# Altium project BPC_PWR_v1.1.PrjPcb (part 2 of 4)
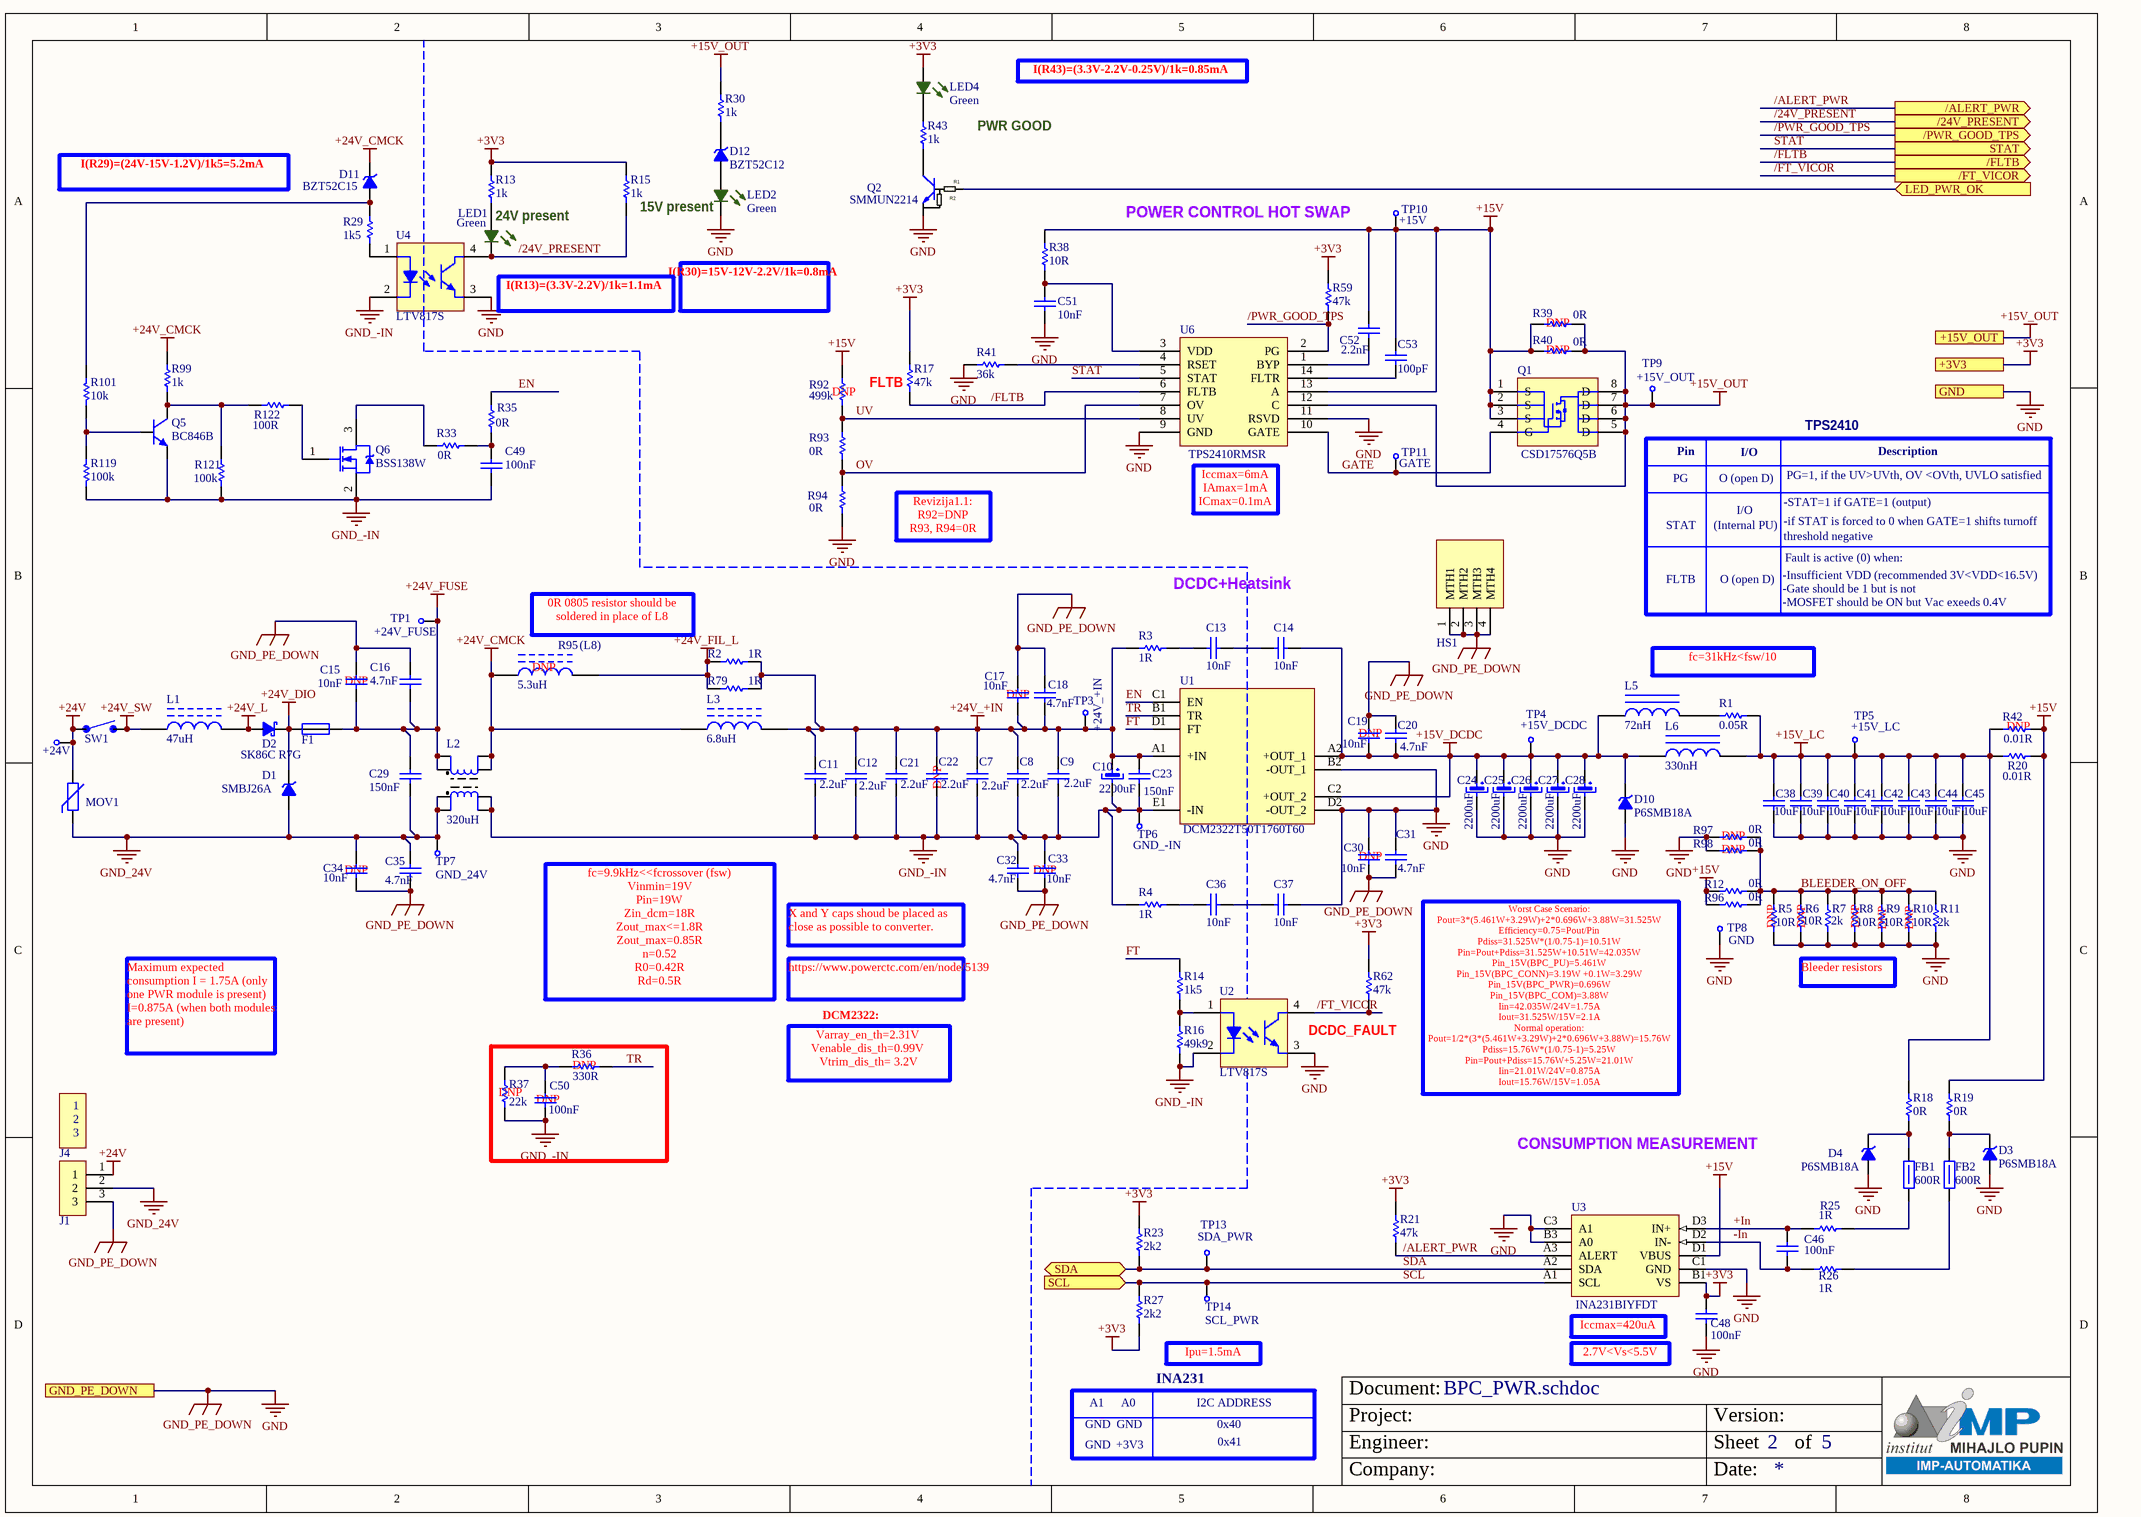
[diagram p5: BPC_PWR.schdoc]

## Sheet BPC_PWR.schdoc: Eurocard VME 6U (9.187 x 6.299 inches) (continued)

### Parts
+24V  Test Point Comment  [TP SMD 1.2mm MS]  (value not drawn)  (no BOM)
C7  Capacitance: 2.2uF  [2220 C 2.8MM MS]  (hidden comment: Ceramic Capacitor)
C8  Capacitance: 2.2uF  [2220 C 2.8MM MS]  (hidden comment: Ceramic Capacitor)
C9  Capacitance: 2.2uF  [2220 C 2.8MM MS]  (hidden comment: Ceramic Capacitor)
C10  Capacitance: 2200uF  [CAPPRD750W85D1800H2000 MS]  (hidden comment: Electorlytic Capacitor)
C11  Capacitance: 2.2uF  [2220 C 2.8MM MS]  (hidden comment: Ceramic Capacitor)
C12  Capacitance: 2.2uF  [2220 C 2.8MM MS]  (hidden comment: Ceramic Capacitor)
C13  Capacitance: 10nF  [1812 C 2.0MM MS]  (hidden comment: Ceramic Capacitor)
C14  Capacitance: 10nF  [1812 C 2.0MM MS]  (hidden comment: Ceramic Capacitor)
C15  Populated: DNP  DB Parameter 1: 10nF  [R46KI21000001M]  (hidden comment: Capacitor Y2)
C16  DB Parameter 1: 4.7nF  [R60QF14704001K]  (hidden comment: Capacitor Y2)
C17  Populated: DNP  DB Parameter 1: 10nF  [R46KI21000001M]  (hidden comment: Capacitor Y2)
C18  DB Parameter 1: 4.7nF  [R60QF14704001K]  (hidden comment: Capacitor Y2)
C19  Populated: DNP  DB Parameter 1: 10nF  [R46KI21000001M]  (hidden comment: Capacitor Y2)
C20  DB Parameter 1: 4.7nF  [R60QF14704001K]  (hidden comment: Capacitor Y2)
C21  Capacitance: 2.2uF  [2220 C 2.8MM MS]  (hidden comment: Ceramic Capacitor)
C22  Populated: DNP  Capacitance: 2.2uF  [2220 C 2.8MM MS]  (hidden comment: Ceramic Capacitor)
C23  DB Parameter 1: 150nF  [MKX2 6mmx18mmx12.5mm]  (hidden comment: Capacitor X2)
C24  Capacitance: 2200uF  [CAPPRD750W85D1800H2000 MS]  (hidden comment: Electorlytic Capacitor)
C25  Capacitance: 2200uF  [CAPPRD750W85D1800H2000 MS]  (hidden comment: Electorlytic Capacitor)
C26  Capacitance: 2200uF  [CAPPRD750W85D1800H2000 MS]  (hidden comment: Electorlytic Capacitor)
C27  Capacitance: 2200uF  [CAPPRD750W85D1800H2000 MS]  (hidden comment: Electorlytic Capacitor)
C28  Capacitance: 2200uF  [CAPPRD750W85D1800H2000 MS]  (hidden comment: Electorlytic Capacitor)
C29  DB Parameter 1: 150nF  [MKX2 6mmx18mmx12.5mm]  (hidden comment: Capacitor X2)
C30  Populated: DNP  DB Parameter 1: 10nF  [R46KI21000001M]  (hidden comment: Capacitor Y2)
C31  DB Parameter 1: 4.7nF  [R60QF14704001K]  (hidden comment: Capacitor Y2)
C32  DB Parameter 1: 4.7nF  [R60QF14704001K]  (hidden comment: Capacitor Y2)
C33  Populated: DNP  DB Parameter 1: 10nF  [R46KI21000001M]  (hidden comment: Capacitor Y2)
C34  Populated: DNP  DB Parameter 1: 10nF  [R46KI21000001M]  (hidden comment: Capacitor Y2)
C35  DB Parameter 1: 4.7nF  [R60QF14704001K]  (hidden comment: Capacitor Y2)
C36  Capacitance: 10nF  [1812 C 2.0MM MS]  (hidden comment: Ceramic Capacitor)
C37  Capacitance: 10nF  [1812 C 2.0MM MS]  (hidden comment: Ceramic Capacitor)
C38  Capacitance: 10uF  [2220 C 2.8MM MS]  (hidden comment: Ceramic Capacitor)
C39  Capacitance: 10uF  [2220 C 2.8MM MS]  (hidden comment: Ceramic Capacitor)
C40  Capacitance: 10uF  [2220 C 2.8MM MS]  (hidden comment: Ceramic Capacitor)
C41  Capacitance: 10uF  [2220 C 2.8MM MS]  (hidden comment: Ceramic Capacitor)
C42  Capacitance: 10uF  [2220 C 2.8MM MS]  (hidden comment: Ceramic Capacitor)
C43  Capacitance: 10uF  [2220 C 2.8MM MS]  (hidden comment: Ceramic Capacitor)
C44  Capacitance: 10uF  [2220 C 2.8MM MS]  (hidden comment: Ceramic Capacitor)
C45  Capacitance: 10uF  [2220 C 2.8MM MS]  (hidden comment: Ceramic Capacitor)
C46  Capacitance: 100nF  [C0603L 0.8 MM MS]  (hidden comment: Ceramic Capacitor)
C48  Capacitance: 100nF  [C0603L 0.8 MM MS]  (hidden comment: Ceramic Capacitor)
C49  Capacitance: 100nF  [C0603L 0.8 MM MS]  (hidden comment: Ceramic Capacitor)
C50  Production Status: DNP  Capacitance: 100nF  [C0603L 0.8 MM MS]  (hidden comment: Ceramic Capacitor)
C51  Capacitance: 10nF  [C0603L 0.8 MM MS]  (hidden comment: Ceramic Capacitor)
C52  Capacitance: 2.2nF  [C0603L 0.8 MM MS]  (hidden comment: Ceramic Capacitor)
C53  Capacitance: 100pF  [C0603L 0.8 MM MS]  (hidden comment: Ceramic Capacitor)
D1  SMBJ26A  [DO-214AA SMB MS]
D2  SK86C R7G  [DIOM7959X262N]
D3  P6SMB18A  [DO-214AA SMB MS]
D4  P6SMB18A  [DO-214AA SMB MS]
D10  P6SMB18A  [DO-214AA SMB MS]
D11  BZT52C15  [SOD-123 MS]
D12  BZT52C12  [SOD-123 MS]
F1  FUSEHOLDER  [FUSEHOLDER_00318221]  (value not drawn)
FB1  Impedance @ 100MHz: 600R  [0805 FB 0.85mm MS]  (hidden comment: Ferrite Bead)
FB2  Impedance @ 100MHz: 600R  [0805 FB 0.85mm MS]  (hidden comment: Ferrite Bead)
HS1  Heatsink  [Heatsink VICOR Tranverse Grounding Tabs Thermal 40138]  (value not drawn)
J1  Header Male TH 3-pin  [MSTB 2,5_3-GF-5,08 - 1776511]  (value not drawn)
J4  Header Male TH 3-pin  [MSTB 2,5/ 3-STF-5,08 - 1777992]  (value not drawn)  (mechanical)
L1  Inductance: 47uH  [SER1390153MLB]  (hidden comment: Inductor)
L2  Inductance: 320uH  [WE-UCF]  (hidden comment: Inductor Common Mode Choke)
L3  Inductance: 6.8uH  [INDPM110100X400N_MSS1048]  (hidden comment: Inductor)
L5  Inductance: 72nH  [IFLR2727]  (hidden comment: Inductor)
L6  Inductance: 330nH  [IHLP3232]  (hidden comment: Inductor)
LED1  Green  [LED GRN Mentor 2632.8380 x1]
LED2  Green  [LED GRN Mentor 2632.8380 x1]
LED4  Green  [LED GRN Mentor 2632.8380 x1]
MOV1  Varistor  [MOV10D470K]  (value not drawn)
Q1  CSD17576Q5B  [DNK8 MS]
Q2  SMMUN2214  [SOT-23 MS]
Q5  BC846B  [SOT-23 NXP MS]
Q6  BSS138W  [SOT65P210X110-3N]
R1  Resistance: 0.05R  [2512 R 0.7mm MS]  (hidden comment: Resistor)
R2  Resistance: 1R  [2512 R 0.7mm MS]  (hidden comment: Resistor)
R3  Resistance: 1R  [2512 R 0.7mm MS]  (hidden comment: Resistor)
R4  Resistance: 1R  [2512 R 0.7mm MS]  (hidden comment: Resistor)
R5  Populated: DNP  Resistance: 10R  [2512 R 0.7mm MS]  (hidden comment: Resistor)
R6  Populated: DNP  Resistance: 10R  [2512 R 0.7mm MS]  (hidden comment: Resistor)
R7  Resistance: 2k  [2512 R 0.7mm MS]  (hidden comment: Resistor)
R8  Populated: DNP  Resistance: 10R  [2512 R 0.7mm MS]  (hidden comment: Resistor)
R9  Populated: DNP  Resistance: 10R  [2512 R 0.7mm MS]  (hidden comment: Resistor)
R10  Populated: DNP  Resistance: 10R  [2512 R 0.7mm MS]  (hidden comment: Resistor)
R11  Resistance: 2k  [2512 R 0.7mm MS]  (hidden comment: Resistor)
R12  Resistance: 0R  [R0603L 0.45MM MS]  (hidden comment: Resistor)
R13  Resistance: 1k  [R0603L 0.45MM MS]  (hidden comment: Resistor)
R14  Resistance: 1k5  [R0603L 0.45MM MS]  (hidden comment: Resistor)
R15  Resistance: 1k  [R0603L 0.45MM MS]  (hidden comment: Resistor)
R16  Resistance: 49k9  [R0603L 0.45MM MS]  (hidden comment: Resistor)
R17  Resistance: 47k  [R0603L 0.45MM MS]  (hidden comment: Resistor)
R18  Resistance: 0R  [0805 R 0.5mm MS]  (hidden comment: Resistor)
R19  Resistance: 0R  [0805 R 0.5mm MS]  (hidden comment: Resistor)
R20  Resistance: 0.01R  [2512 R 0.7mm MS]  (hidden comment: Resistor)
R21  Resistance: 47k  [R0603L 0.45MM MS]  (hidden comment: Resistor)
R23  Resistance: 2k2  [R0603L 0.45MM MS]  (hidden comment: Resistor)
R25  Resistance: 1R  [R0603L 0.45MM MS]  (hidden comment: Resistor)
R26  Resistance: 1R  [R0603L 0.45MM MS]  (hidden comment: Resistor)
R27  Resistance: 2k2  [R0603L 0.45MM MS]  (hidden comment: Resistor)
R29  Resistance: 1k5  [R0603L 0.45MM MS]  (hidden comment: Resistor)
R30  Resistance: 1k  [R0603L 0.45MM MS]  (hidden comment: Resistor)
R33  Resistance: 0R  [R0603L 0.45MM MS]  (hidden comment: Resistor)
R35  Resistance: 0R  [R0603L 0.45MM MS]  (hidden comment: Resistor)
R36  Populated: DNP  Resistance: 330R  [R0603L 0.45MM MS]  (hidden comment: Resistor)
R37  Populated: DNP  Resistance: 22k  [R0603L 0.45MM MS]  (hidden comment: Resistor)
R38  Resistance: 10R  [1206 R 0.6mm MS]  (hidden comment: Resistor)
R39  Populated: DNP  Resistance: 0R  [2512 R 0.7mm MS]  (hidden comment: Resistor)
R40  Populated: DNP  Resistance: 0R  [2512 R 0.7mm MS]  (hidden comment: Resistor)
R41  Resistance: 36k  [R0603L 0.45MM MS]  (hidden comment: Resistor)
R42  Populated: DNP  Resistance: 0.01R  [2512 R 0.7mm MS]  (hidden comment: Resistor)
R43  Resistance: 1k  [R0603L 0.45MM MS]  (hidden comment: Resistor)
R59  Resistance: 47k  [R0603L 0.45MM MS]  (hidden comment: Resistor)
R62  Resistance: 47k  [R0603L 0.45MM MS]  (hidden comment: Resistor)
R79  Resistance: 1R  [2512 R 0.7mm MS]  (hidden comment: Resistor)
R92  Populated: DNP  Resistance: 499k  [R0603L 0.45MM MS]  (hidden comment: Resistor)
R93  Resistance: 0R  [R0603L 0.45MM MS]  (hidden comment: Resistor)
R94  Resistance: 0R  [R0603L 0.45MM MS]  (hidden comment: Resistor)
R95  Populated: DNP  Inductance: 5.3uH  [WE-TPC_5818/582892]  (hidden comment: Inductor)
R96  Resistance: 0R  [R0603L 0.45MM MS]  (hidden comment: Resistor)
R97  Populated: DNP  Resistance: 0R  [R0603L 0.45MM MS]  (hidden comment: Resistor)
R98  Populated: DNP  Resistance: 0R  [R0603L 0.45MM MS]  (hidden comment: Resistor)
R99  Resistance: 1k  [R0603L 0.45MM MS]  (hidden comment: Resistor)
R101  Resistance: 10k  [R0603L 0.45MM MS]  (hidden comment: Resistor)
R119  Resistance: 100k  [R0603L 0.45MM MS]  (hidden comment: Resistor)
R121  Resistance: 100k  [R0603L 0.45MM MS]  (hidden comment: Resistor)
R122  Resistance: 100R  [R0603L 0.45MM MS]  (hidden comment: Resistor)
SW1  Switch  [SWITCH_HOLES]  (value not drawn)
TP1  +24V_FUSE  [TP SMD 1.2mm MS]  (no BOM)
TP3  +24V_+IN  [TP SMD 1.2mm MS]  (no BOM)
TP4  +15V_DCDC  [TP SMD 1.2mm MS]  (no BOM)
TP5  +15V_LC  [TP SMD 1.2mm MS]  (no BOM)
TP6  GND_-IN  [TP SMD 1.2mm MS]  (no BOM)
TP7  GND_24V  [TP SMD 1.2mm MS]  (no BOM)
TP8  GND  [TP SMD 1.2mm MS]  (no BOM)
TP9  +15V_OUT  [TP SMD 1.2mm MS]  (no BOM)
TP10  +15V  [TP SMD 1.2mm MS]  (no BOM)
TP11  GATE  [TP SMD 1.2mm MS]  (no BOM)
TP13  SDA_PWR  [TP SMD 1.2mm MS]  (no BOM)
TP14  SCL_PWR  [TP SMD 1.2mm MS]  (no BOM)
U1  DCM2322T50T1760T60  [DCM2322 MS]
U2  LTV817S  [LTV814S]
U3  INA231BIYFDT  [DSBGA-12]
U4  LTV817S  [LTV814S]
U6  TPS2410RMSR  [QFN50P250X250X60-14N]

### Ports
+3V3, +15V_OUT, /24V_PRESENT (out), /ALERT_PWR (out), /FLTB (out), /FT_VICOR (out), /PWR_GOOD_TPS (out), GND, GND_PE_DOWN, LED_PWR_OK (in), SCL (in), SDA (bidir), STAT (out)

### Nets
+3V3: C48.1 LED4.A R13.2 R15.1 R17.2 R21.2 R23.2 R27.2 R59.2 R62.2 U3.B1(VS) ; port +3V3
+15V: C52.2 C53.1 Q1.1(S) Q1.2(S) Q1.3(S) R12.2 R19.2 R20.2 R38.2 R39.1 R40.1 R42.2 R92.2 R96.2 TP10.1 U3.D1(VBUS) U6.13(A)
+15V_DCDC: C14.1 C19.2 C20.2 C24.1 C25.1 C26.1 C27.1 C28.1 D10.K L5.1 L6.1 TP4.1 U1.A2(+OUT_1) U1.C2(+OUT_2)
+15V_LC: C38.1 C39.1 C40.1 C41.1 C42.1 C43.1 C44.1 C45.1 L6.2 R1.2 R18.2 R20.1 R42.1 TP5.1
+15V_OUT: Q1.5(D) Q1.6(D) Q1.7(D) Q1.8(D) R30.2 R39.2 R40.2 TP9.1 U6.12(C) ; port +15V_OUT
+24V: +24V.1 J1.1 MOV1.2 SW1.1
+24V_+IN: C7.1 C8.1 C9.1 C10.1 C11.1 C12.1 C17.1 C18.2 C21.1 C22.1 C23.1 L3.2 R2.2 R3.1 R79.2 TP3.1 U1.A1(+IN)
+24V_CMCK: D11.K L2.9 L2.10 L3.1 R95.1 R99.1
+24V_DIO: D1.K D2.1(K) F1.1
+24V_FIL_L: R2.1 R79.1 R95.2
+24V_FUSE: C15.2 C16.2 C29.1 F1.2 L2.1 L2.2 TP1.1
+24V_L: D2.2(A) L1.2
+24V_SW: L1.1 SW1.2
GND: C15.1 C16.1 C17.2 C18.1 C19.1 C20.1 C24.2 C25.2 C26.2 C27.2 C28.2 C30.1 C30.2 C31.1 C31.2 C32.2 C33.2 C34.2 C35.2 C37.1 C38.2 C39.2 C40.2 C41.2 C42.2 C43.2 C44.2 C45.2 C48.2 C51.1 D3.A D4.A D10.A HS1.1(MTH1) HS1.2(MTH2) HS1.3(MTH3) HS1.4(MTH4) J1.3 LED2.K Q2.2 R5.1 R6.1 R7.1 R8.1 R9.1 R10.1 R11.1 R41.1 R94.1 R97.2 R98.2 TP8.1 U1.B2(-OUT_1) U1.D2(-OUT_2) U2.3(Emitter) U3.B3(A0) U3.C1(GND) U3.C3(A1) U4.3(Emitter) U6.9(GND) U6.11(RSVD) ; port GND_PE_DOWN, port GND  [also labelled GND_PE_DOWN]
GND_24V: C29.2 C34.1 C35.1 D1.A J1.2 L2.4 L2.5 MOV1.1 TP7.1
GND_-IN: C7.2 C8.2 C9.2 C10.2 C11.2 C12.2 C21.2 C22.2 C23.2 C32.1 C33.1 C49.2 C50.2 L2.6 L2.7 Q5.2(E) Q6.2(S) R4.1 R16.1 R37.1 R119.1 R121.2 TP6.1 U1.E1(-IN) U2.2(Cathode) U4.2(Cathode)
+In: C46.1 R25.1 U3.D3(IN+)
-In: C46.2 R26.1 U3.D2(IN-)
/24V_PRESENT: LED1.K R15.2 U4.4(Collector) ; port /24V_PRESENT
/ALERT_PWR: R21.1 U3.A3(ALERT) ; port /ALERT_PWR
/FLTB: R17.1 U6.6(FLTB) ; port /FLTB
/FT_VICOR: R62.1 U2.4(Collector) ; port /FT_VICOR
/PWR_GOOD_TPS: R59.1 U6.2(PG) ; port /PWR_GOOD_TPS
BLEEDER_ON_OFF: R5.2 R6.2 R7.2 R8.2 R9.2 R10.2 R11.2 R12.1 R96.1 R97.1 R98.1
EN: R35.1 U1.C1(EN)
FT: R14.2 U1.D1(FT)
GATE: Q1.4(G) TP11.1 U6.10(GATE)
LED_PWR_OK: Q2.1 ; port LED_PWR_OK
OV: R93.1 R94.2 U6.7(OV)
SCL: R27.1 TP14.1 U3.A1(SCL) ; port SCL
SDA: R23.1 TP13.1 U3.A2(SDA) ; port SDA
STAT: U6.5(STAT) ; port STAT
TR: R36.2 U1.B1(TR)
UV: R92.1 R93.2 U6.8(UV)
NetC13_1: C13.1 C14.2
NetC13_2: C13.2 R3.2
NetC36_1: C36.1 C37.2
NetC36_2: C36.2 R4.2
NetC49_1: C49.1 R33.2 R35.2
NetC50_1: C50.1 R36.1 R37.2
NetC51_2: C51.2 R38.1 U6.3(VDD)
NetC52_1: C52.1 U6.1(BYP)
NetC53_2: C53.2 U6.14(FLTR)
NetD3_K: D3.K FB2.1 R19.1
NetD4_K: D4.K FB1.1 R18.1
NetD11_A: D11.A R29.2 R101.2
NetD12_A: D12.A LED2.A
NetD12_K: D12.K R30.1
NetFB1_2: FB1.2 R25.2
NetFB2_2: FB2.2 R26.2
NetL5_2: L5.2 R1.1
NetLED1_A: LED1.A R13.1
NetLED4_K: LED4.K R43.2
NetQ2_3: Q2.3 R43.1
NetQ5_1: Q5.1(B) R101.1 R119.2
NetQ5_3: Q5.3(C) R99.2 R121.1 R122.1
NetQ6_1: Q6.1(G) R122.2
NetQ6_3: Q6.3(D) R33.1
NetR14_1: R14.1 R16.2 U2.1(Anode)
NetR29_1: R29.1 U4.1(Anode)
NetR41_2: R41.2 U6.4(RSET)

### Notes on the sheet
- I(R43)=(3.3V-2.2V-0.25V)/1k=0.85mA
- I(R29)=(24V-15V-1.2V)/1k5=5.2mA
- PWR GOOD
- 24V present
- (near LED2) 15V present
- POWER CONTROL HOT SWAP
- I(R13)=(3.3V-2.2V)/1k=1.1mA
- I(R30)=15V-12V-2.2V/1k=0.8mA
- (near R17) FLTB
- Pin
- I/O
- TPS2410
- Description
- (near U6) Iccmax=6mA
  IAmax=1mA
  ICmax=0.1mA
- PG
- O (open D)
- -STAT=1 if GATE=1 (output)
- -if STAT is forced to 0 when GATE=1 shifts turnoff
- PG=1, if the UV>UVth, OV <OVth, UVLO satisfied
- Revizija1.1:
  R92=DNP
  R93, R94=0R
- DCDC+Heatsink
- STAT
- FLTB
- (Internal PU)
- -Insufficient VDD (recommended 3V<VDD<16.5V)
- -Gate should be 1 but is not
- threshold negative
- Fault is active (0) when:
- 0R 0805 resistor should be soldered in place of L8
- (near R95) (L8)
- -MOSFET should be ON but Vac exeeds 0.4V
- fc=31kHz<fsw/10
- fc=9.9kHz<<fcrossover (fsw)
  Vinmin=19V
  Pin=19W
  Zin_dcm=18R
  Zout_max<=1.8R
  Zout_max=0.85R
  n=0.52
  R0=0.42R
  Rd=0.5R
- X and Y caps shoud be placed as close as possible to converter.
- https://www.powerctc.com/en/node/5139
- Bleeder resistors
- Maximum expected consumption I = 1.75A (only one PWR module is present)
  I=0.875A (when both modules are present)
- DCM2322:
- DCDC_FAULT
- Varray_en_th=2.31V
  Venable_dis_th=0.99V
  Vtrim_dis_th= 3.2V
- Worst Case Scenario:
  Pout=3*(5.461W+3.29W)+2*0.696W+3.88W=31.525W
  Efficiency=0.75=Pout/Pin
  Pdiss=31.525W*(1/0.75-1)=10.51W
  Pin=Pout+Pdiss=31.525W+10.51W=42.035W
  Pin_15V(BPC_PU)=5.461W
  Pin_15V(BPC_CONN)=3.19W +0.1W=3.29W
  Pin_15V(BPC_PWR)=0.696W
  Pin_15V(BPC_COM)=3.88W
  Iin=42.035W/24V=1.75A
  Iout=31.525W/15V=2.1A
  Normal operation:
  Pout=1/2*(3*(5.461W+3.29W)+2*0.696W+3.88W)=15.76W
  Pdiss=15.76W*(1/0.75-1)=5.25W
  Pin=Pout+Pdiss=15.76W+5.25W=21.01W
  Iin=21.01W/24V=0.875A
  Iout=15.76W/15V=1.05A
- CONSUMPTION MEASUREMENT
- Iccmax=420uA
- A1
- A0
- INA231
- Ipu=1.5mA
- I2C ADDRESS
- 2.7V<Vs<5.5V
- GND
- +3V3
- 0x40
- 0x41
- Document:
- Project:
- Engineer:
- Version:
- Sheet
- of
- Company:
- Date:
- (in symbol Mech Con Cable 1x3 5.08 Phoenix MS) 1; 2; 3
- (in symbol Tra NPN Prebias MS) R1; R2